# Altium schematic sheet STSPIN32F0A ESC5.SchDoc
size A3
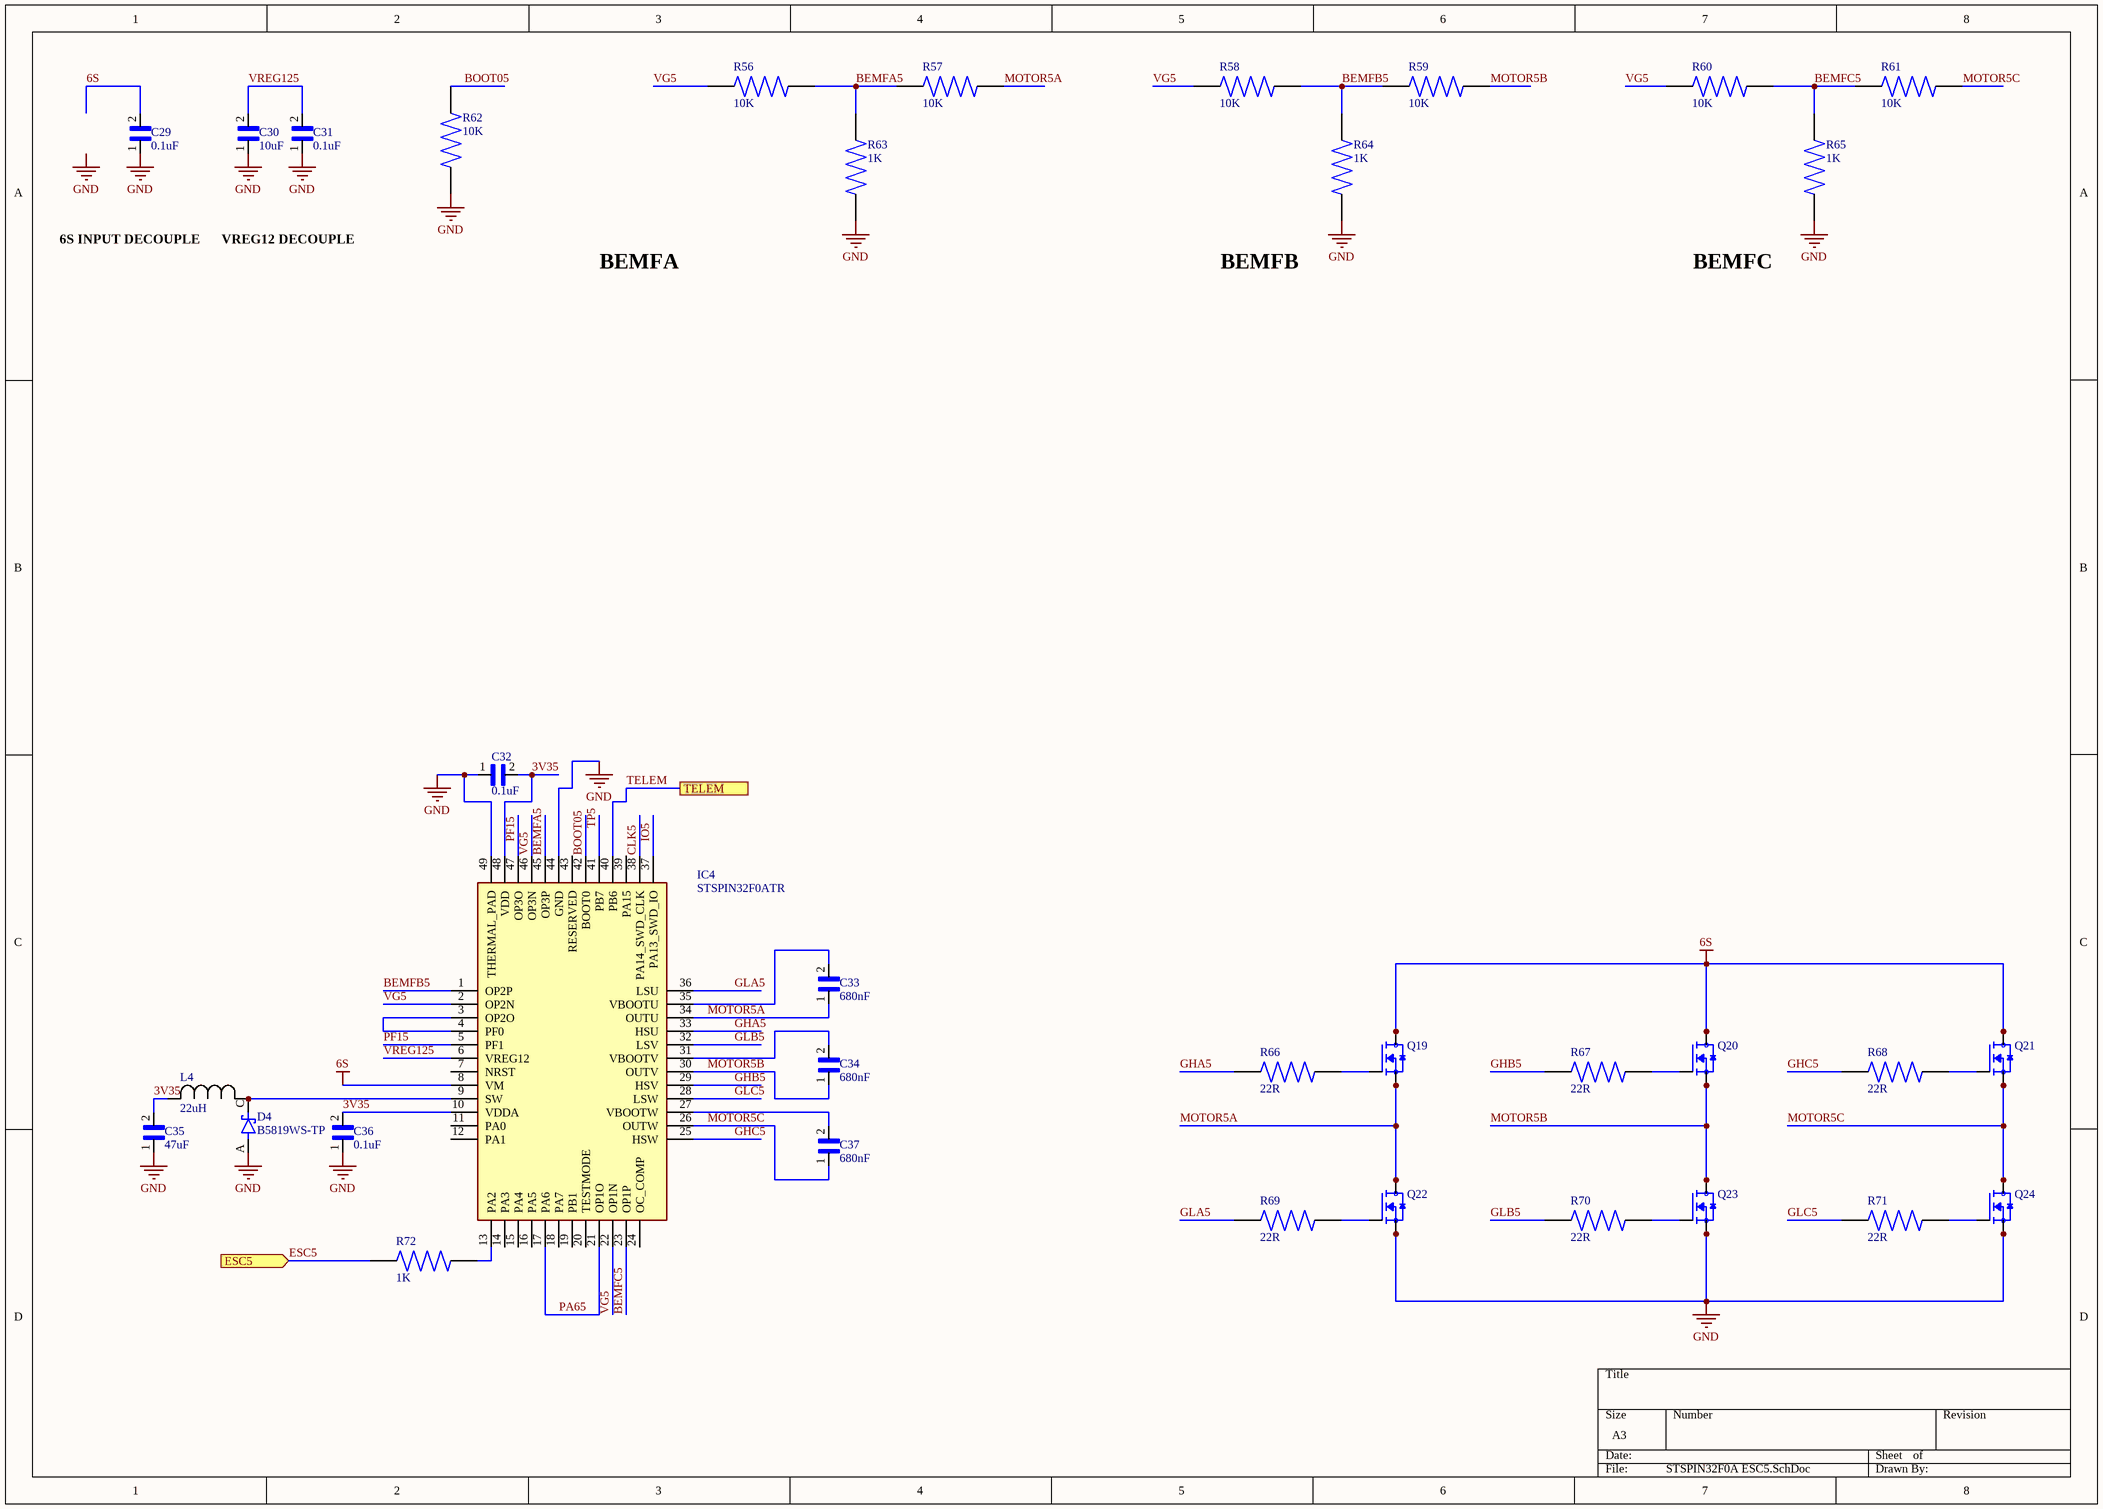
[diagram p0: STSPIN32F0A ESC5.SchDoc]

## Parts
C29  0.1uF  [CAPC1005X55N]
C30  10uF  [CAPC1608X90N]
C31  0.1uF  [CAPC1005X55N]
C32  0.1uF  [CAPC1005X55N]
C33  680nF  [CAPC1005X55N]
C34  680nF  [CAPC1005X55N]
C35  47uF  [CAPC1608X90N]
C36  0.1uF  [CAPC1005X55N]
C37  680nF  [CAPC1005X55N]
D4  B5819WS-TP  [SOD2512X115N]
IC4  STSPIN32F0ATR  [QFN50P700X700X100-49N-D]
L4  22uH  [IND_BOURNS_SRN3015]
Q19  TPHR8504PL,L1Q  [TRANS_TPHR8504PL,L1Q]  (value not drawn)
Q20  TPHR8504PL,L1Q  [TRANS_TPHR8504PL,L1Q]  (value not drawn)
Q21  TPHR8504PL,L1Q  [TRANS_TPHR8504PL,L1Q]  (value not drawn)
Q22  TPHR8504PL,L1Q  [TRANS_TPHR8504PL,L1Q]  (value not drawn)
Q23  TPHR8504PL,L1Q  [TRANS_TPHR8504PL,L1Q]  (value not drawn)
Q24  TPHR8504PL,L1Q  [TRANS_TPHR8504PL,L1Q]  (value not drawn)
R56  10K  [RESC1005X37N]
R57  10K  [RESC1005X37N]
R58  10K  [RESC1005X37N]
R59  10K  [RESC1005X37N]
R60  10K  [RESC1005X37N]
R61  10K  [RESC1005X37N]
R62  10K  [RESC1005X37N]
R63  1K  [RESC1005X37N]
R64  1K  [RESC1005X37N]
R65  1K  [RESC1005X37N]
R66  22R  [RESC1005X37N]
R67  22R  [RESC1005X37N]
R68  22R  [RESC1005X37N]
R69  22R  [RESC1005X37N]
R70  22R  [RESC1005X37N]
R71  22R  [RESC1005X37N]
R72  1K  [RESC1005X37N]

## Ports
ESC5 (in), TELEM

## Nets
6S: C29.2 IC4.8(VM) Q19.5(D) Q19.6(D) Q19.7(D) Q19.8(D) Q19.9(D) Q20.5(D) Q20.6(D) Q20.7(D) Q20.8(D) Q20.9(D) Q21.5(D) Q21.6(D) Q21.7(D) Q21.8(D) Q21.9(D)
GND: C29.1 C30.1 C31.1 C32.1 C35.1 C36.1 D4.A IC4.44(GND) IC4.49(THERMAL_PAD) Q22.1(S) Q22.2(S) Q22.3(S) Q23.1(S) Q23.2(S) Q23.3(S) Q24.1(S) Q24.2(S) Q24.3(S) R62.1 R63.2 R64.2 R65.2
3V35: C32.2 C35.2 C36.2 IC4.10(VDDA) IC4.48(VDD) L4.2
BEMFA5: IC4.45(OP3P) R56.1 R57.2 R63.1
BEMFB5: IC4.1(OP2P) R58.1 R59.2 R64.1
BEMFC5: IC4.23(OP1P) R60.1 R61.2 R65.1
BOOT05: IC4.42(BOOT0) R62.2
CLK5: IC4.38(PA14_SWD_CLK)
ESC5: R72.1 ; port ESC5
GHA5: IC4.33(HSU) R66.2
GHB5: IC4.29(HSV) R67.2
GHC5: IC4.25(HSW) R68.2
GLA5: IC4.36(LSU) R69.2
GLB5: IC4.32(LSV) R70.2
GLC5: IC4.28(LSW) R71.2
IO5: IC4.37(PA13_SWD_IO)
MOTOR5A: C33.1 IC4.34(OUTU) Q19.1(S) Q19.2(S) Q19.3(S) Q22.5(D) Q22.6(D) Q22.7(D) Q22.8(D) Q22.9(D) R57.1
MOTOR5B: C34.1 IC4.30(OUTV) Q20.1(S) Q20.2(S) Q20.3(S) Q23.5(D) Q23.6(D) Q23.7(D) Q23.8(D) Q23.9(D) R59.1
MOTOR5C: C37.1 IC4.26(OUTW) Q21.1(S) Q21.2(S) Q21.3(S) Q24.5(D) Q24.6(D) Q24.7(D) Q24.8(D) Q24.9(D) R61.1
PA65: IC4.17(PA6) IC4.21(OP1O)
PF15: IC4.5(PF1) IC4.47(OP3O)
TELEM: IC4.40(PB6) ; port TELEM
TP5: IC4.41(PB7)
VG5: IC4.2(OP2N) IC4.22(OP1N) IC4.46(OP3N) R56.2 R58.2 R60.2
VREG125: C30.2 C31.2 IC4.6(VREG12)
NetC33_2: C33.2 IC4.35(VBOOTU)
NetC34_2: C34.2 IC4.31(VBOOTV)
NetC37_2: C37.2 IC4.27(VBOOTW)
NetD4_C: D4.C(K) IC4.9(SW) L4.1
NetIC4_3: IC4.3(OP2O) IC4.4(PF0)
NetIC4_13: IC4.13(PA2) R72.2
NetQ19_4: Q19.4(G) R66.1
NetQ20_4: Q20.4(G) R67.1
NetQ21_4: Q21.4(G) R68.1
NetQ22_4: Q22.4(G) R69.1
NetQ23_4: Q23.4(G) R70.1
NetQ24_4: Q24.4(G) R71.1

Not connected (* = marked no-connect by the designer): IC4 7(NRST) 11(PA0) 12(PA1) 14(PA3) 15(PA4) 16(PA5) 18(PA7) 19(PB1) 20(TESTMODE) 24(OC_COMP) 39(PA15) 43(RESERVED)

## Notes on the sheet
- 6S INPUT DECOUPLE
- VREG12 DECOUPLE
- BEMFA
- BEMFB
- BEMFC
- Labels drawn without touching a wire or pin: GND

## Library data of the parts
C29 C31-C34 C36 C37 = GRM1555C1H222JA01D: Package: None; Price: None; Value: *; MP: GRM1555C1H222JA01D; Availability: Unavailable
C30 C35 = GRM188R71E224JA88D: SMD Capacitor X7R(EIA) with Capacitance: 0.22uF Tol. 5%. Rated Voltage: 25Vdc; Package: None; Price: None; Value: *; MP: GRM188R71E224JA88D; Availability: Unavailable
D4 = B5819WS-TP: MF: {'manufacturer': u'Micro Commercial Components'}; Package: None; MP: B5819WS-TP; Price: None; Availability: Unavailable; Value: *
IC4 = STSPIN32F0ATR: Integrated Circuit; Manufacturer_Name: STMicroelectronics; Datasheet Link: http://www.st.com/content/ccc/resource/technical/document/datasheet/group3/3d/88/0f/d1/3f/0c/49/80/DM00406030/files/DM00406030.pdf/jcr:content/translations/en.DM00406030.pdf; Height: 1mm; Manufacturer_Part_Number: STSPIN32F0ATR; Mouser Part Number: 511-STSPIN32F0ATR; Mouser Price/Stock: https://www.mouser.co.uk/ProductDetail/STMicroelectronics/STSPIN32F0ATR?qs=1mbolxNpo8flc7yUpKWOVQ%3D%3D; Arrow Part Number: STSPIN32F0ATR; Arrow Price/Stock: https://www.arrow.com/en/products/stspin32f0atr/stmicroelectronics
L4 = SRN3015-220M: No Description Available; Mfr_Name: Bourns Electronics; Type: DEV; Copyright: Copyright (C) 2022 Ultra Librarian. All rights reserved.; Manufacturer_Part_Number: SRN3015-220M; Digi-Key_Part_Number_1: SRN3015-220MCT-ND; Digi-Key_Part_Number_2: SRN3015-220MDKR-ND; Digi-Key_Part_Number_3: SRN3015-220MTR-ND; RefDes: RefDes
Q19-Q24 = TPHR8504PL,L1Q: N-Channel 40V 150A (Tc) 1W (Ta), 170W (Tc) Surface Mount 8-SOP Advance (5x5); MF: Toshiba Semiconductor; Package: SOP-8 Toshiba; Price: None; Value: *; MP: TPHR8504PL,L1Q; SnapEDA_Link: https://www.snapeda.com/parts/TPHR8504PL,L1Q/Toshiba%20Semiconductor%20and%20Storage/view-part/604439/?ref=snap; Availability: Unavailable
R56-R72 = RE0402BRE07330KL: MF: {'manufacturer': u'Yageo'}; Availability: Unavailable; Package: None; MP: RE0402BRE07330KL; Value: *; Price: None